# EasyEDA schematic Proyecto_III_01.json
TITLE: Sheet_1; REV: 1.0; Date: 2023-10-15; Sheet: 1/1; Company: Your Company
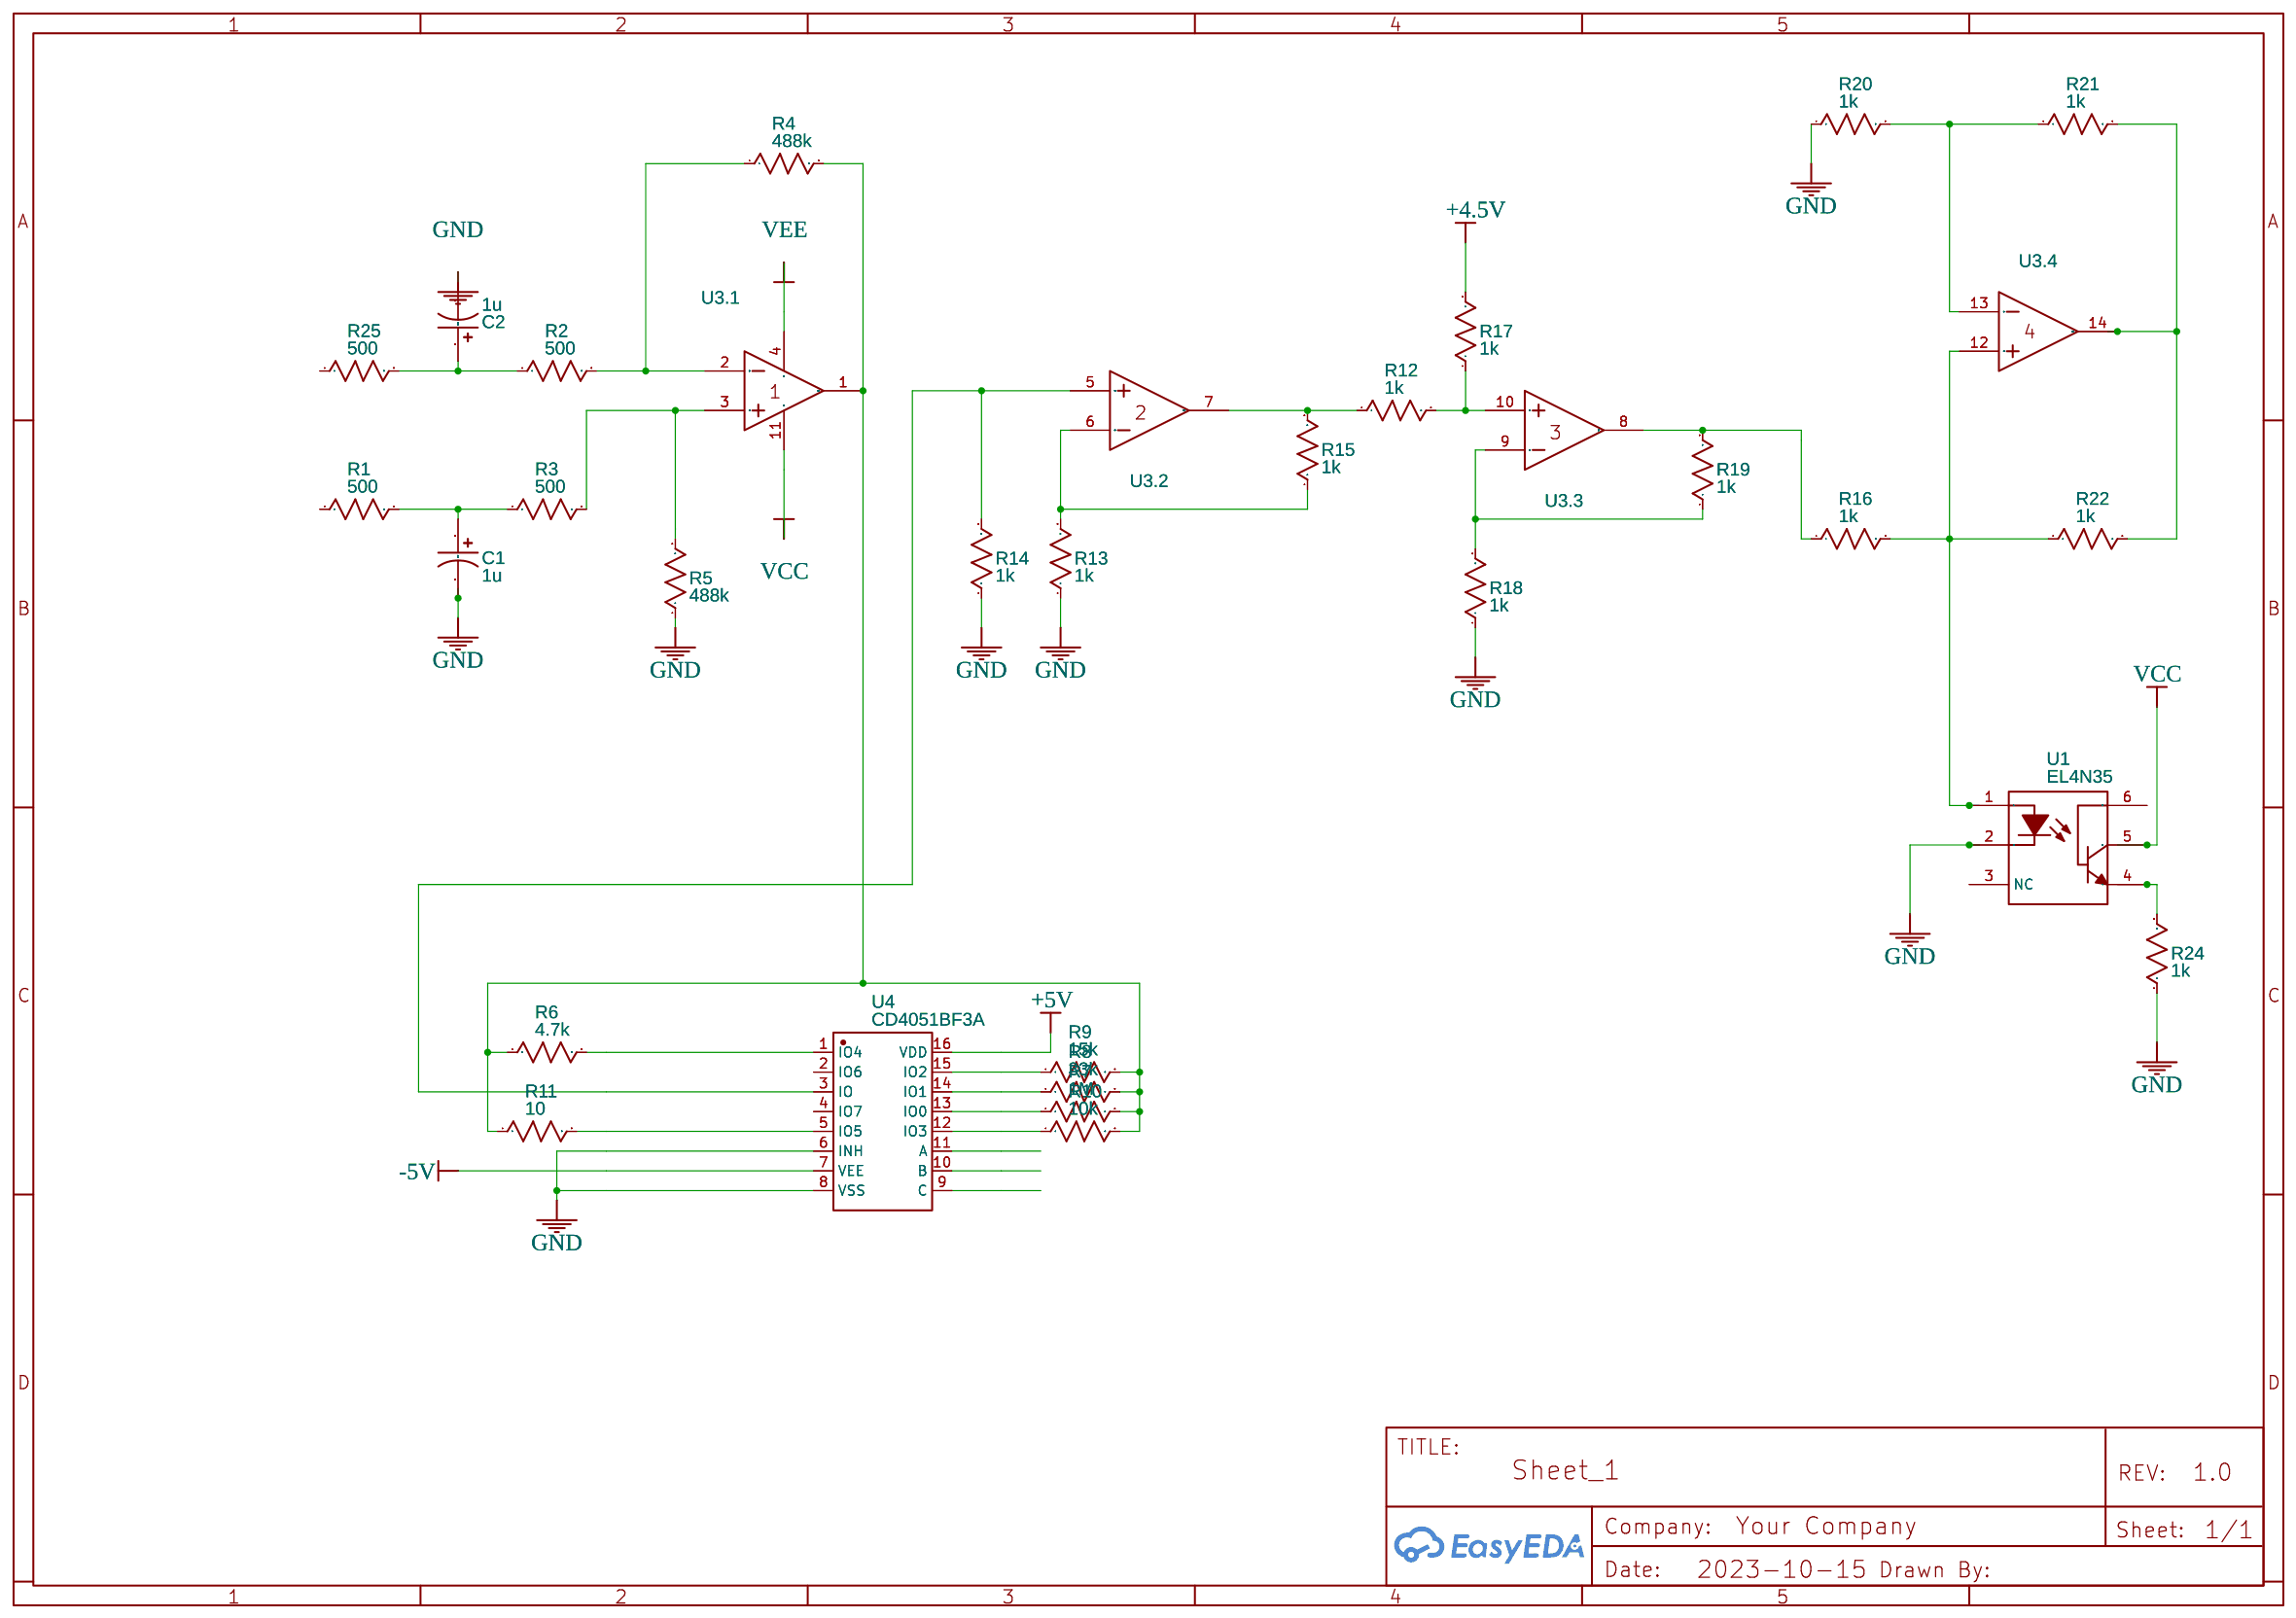
[diagram p0: schematic sheet]

## Parts
C1  1u  [CAP-D4.0×H5.5]
C2  1u  [CAP-D4.0×H5.5]
R1  500  [R_AXIAL-0.3]
R2  500  [R_AXIAL-0.3]
R3  500  [R_AXIAL-0.3]
R4  488k  [R_AXIAL-0.3]
R5  488k  [R_AXIAL-0.3]
R6  4.7k  [R_AXIAL-0.3]
R7  1M  [R_AXIAL-0.3]
R8  33k  [R_AXIAL-0.3]
R9  15k  [R_AXIAL-0.3]
R10  10k  [R_AXIAL-0.3]
R11  10  [R_AXIAL-0.3]
R12  1k  [R_AXIAL-0.3]
R13  1k  [R_AXIAL-0.3]
R14  1k  [R_AXIAL-0.3]
R15  1k  [R_AXIAL-0.3]
R16  1k  [R_AXIAL-0.3]
R17  1k  [R_AXIAL-0.3]
R18  1k  [R_AXIAL-0.3]
R19  1k  [R_AXIAL-0.3]
R20  1k  [R_AXIAL-0.3]
R21  1k  [R_AXIAL-0.3]
R22  1k  [R_AXIAL-0.3]
R24  1k  [R_AXIAL-0.3]
R25  500  [R_AXIAL-0.3]
U1  EL4N35  [DIP-6_L7.3-W6.5-P2.54-LS7.6-BL]
U3  LF347BN/PB  [PDIP-14_L19.6-W6.5-P2.54-LS7.9-BL]  (sections 1,2,3,4)
U4  CD4051BF3A  [DIP-16_L19.7-W6.6-P2.54-LS7.6-BL]

## Library data of the parts
C1 C2 = CE_SMD_D4.0×H5.5_US: Contributor: LCEDA_Lib
R1-R22 R24 R25 = R_AXIAL-0.3_US: Contributor: LCEDA_Lib
U1 = EL4N35: Contributor: LCSC; Supplier: LCSC; Manufacturer: EVERLIGHT(亿光); Supplier Part: C141786; JLCPCB Part Class: Extended Part; link: https://lcsc.com/eda_search?q=C141786&%26type=1&ref=editor
U3 = LF347BN/PB: subpart_no: 1; Supplier: LCSC; Supplier Part: C4370431; Manufacturer: TI(德州仪器); link: https://lcsc.com/eda_search?q=C4370431&%26type=1&ref=editor
U4 = CD4051BF3A: Contributor: lcsc; Supplier: LCSC; Supplier Part: C3033381; Manufacturer: TI(德州仪器); link: https://lcsc.com/eda_search?q=C3033381&%26type=1&ref=editor

## Nets
+4.5V: R17.2
+5V: U4.16(VDD)
-5V: U4.7(VEE)
GND: C1.2 C2.2 R5.1 R13.1 R14.1 R18.1 R20.1 R24.1 U1.2 U4.6(INH) U4.8(VSS)
VCC: U1.5 U3.11(VCC-)
VEE: U3.4(VCC+)
Net-(C1-1): C1.1 R1.2 R3.1
Net-(C2-1): C2.1 R2.1 R25.2
Net-(R2-2): R2.2 R4.1 U3.2(IN1-)
Net-(R3-2): R3.2 R5.2 U3.3(IN1+)
Net-(R4-2): R4.2 R6.1 R7.2 R8.2 R9.2 R10.2 R11.1 U3.1(OUT1)
Net-(R6-2): R6.2 U4.1(IO4)
Net-(R7-1): R7.1 U4.13(IO0)
Net-(R8-1): R8.1 U4.14(IO1)
Net-(R9-1): R9.1 U4.15(IO2)
Net-(R10-1): R10.1 U4.12(IO3)
Net-(R11-2): R11.2 U4.5(IO5)
Net-(R12-1): R12.1 R15.2 U3.7(OUT2)
Net-(R12-2): R12.2 R17.1 U3.10(IN3+)
Net-(R13-2): R13.2 R15.1 U3.6(IN2-)
Net-(R14-2): R14.2 U3.5(IN2+) U4.3(IO)
Net-(R16-1): R16.1 R19.2 U3.8(OUT3)
Net-(R16-2): R16.2 R22.1 U1.1 U3.12(IN4+)
Net-(R18-2): R18.2 R19.1 U3.9(IN3-)
Net-(R20-2): R20.2 R21.1 U3.13(IN4-)
Net-(R21-2): R21.2 R22.2 U3.14(OUT4)
Net-(R24-2): R24.2 U1.4

Not connected (* = marked no-connect by the designer): R1 1; R25 1; U1 3(NC) 6; U4 2(IO6) 4(IO7) 9(C) 10(B) 11(A)
